# EAGLE design SRX-Sensor-Panel (EAGLE 8.4.1)
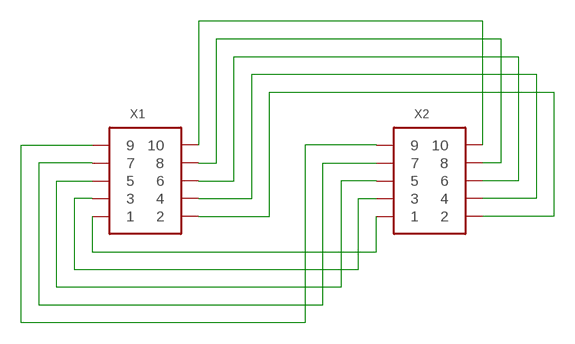
[diagram p0: schematic, sheet 1]

## Parts
X1  CONN_5-2  [FTSH-105-D]
X2  CONN_5-2  [FTSH-105-D]

## Nets
N$1: X1.1 X2.1
N$2: X1.3 X2.3
N$3: X1.5 X2.5
N$4: X1.7 X2.7
N$5: X1.9 X2.9
N$6: X1.10 X2.10
N$7: X1.2 X2.2
N$8: X1.4 X2.4
N$9: X1.6 X2.6
N$10: X1.8 X2.8

## Library data of the parts
X1 X2 = pel_misc:CONN_5-2

## Board
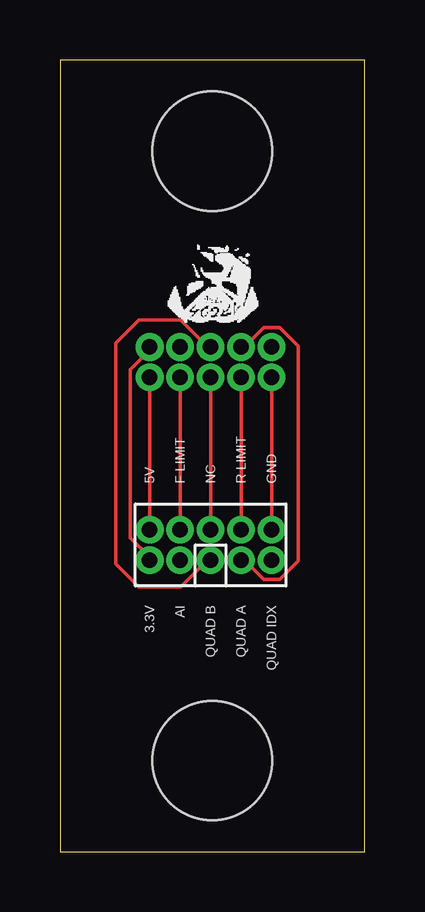
[diagram p1: board, top side]
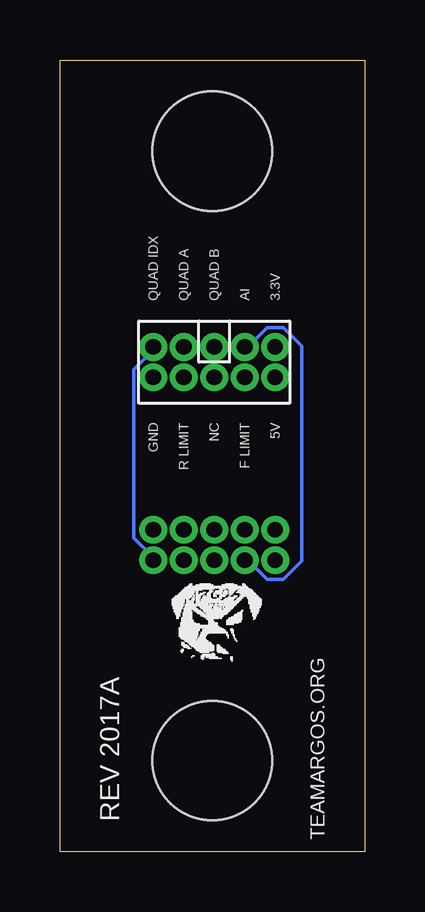
[diagram p2: board, bottom side, seen from below]

Size 12.7 x 33.02 mm. Coordinates in mm from the lower left corner, seen from the top.
Outline: 0,0 12.7,0 12.7,33.02 0,33.02 0,0
Copper layers (1*16): Top 0.035mm / dielectric 1.5mm / Bottom 0.035mm
Design rules "default": minimum track width 6mil, minimum drill 0.35mm, track to track 6mil, track to pad 6mil, pad to pad 6mil, via to via 6mil, smd to smd 6mil, copper to edge 40mil, drill to drill 6mil, minimum pad ring 10mil, minimum via ring 8mil, stop-mask expansion 4mil, vias tented up to drill 0mil, thermal gap 10mil
Holes 4.98 mm at 6.35,3.81 6.35,29.21

### Footprints (pad centres in the part's own frame; a part is rotated, then mirrored left to right if it is on the bottom)
FTSH-105-D = drill 0.65 pad 0.913: 1 -2.54,-0.635; 2 -2.54,0.635; 3 -1.27,-0.635; 4 -1.27,0.635; 5 0,-0.635; 6 0,0.635; 7 1.27,-0.635; 8 1.27,0.635; 9 2.54,-0.635; 10 2.54,0.635

### Placement (x,y rotation side)
X1  6.27,12.8 0 top
X2  6.27,20.42 180 bottom

### Tracks (layer width: path | path; a pad name or v marks a point on that pad's centre or on a via)
N$1
  Top 0.152: X2.1 3.73,20.93 2.93,20.12 2.93,13.1 3.73,12.29 X1.1
N$2  (via drill 0.35)
  Top 0.152: X2.3 v4.88,21.06
  Bottom 0.152: v4.88,21.06 4.07,21.86 3.4,21.86 2.62,21.09 2.62,12.14 3.4,11.36 4.07,11.36 4.88,12.17 X1.3
N$3
  Top 0.152: X2.5 6.15,21.06 5.03,22.17 3.27,22.17 2.32,21.21 2.32,12.01 3.27,11.05 5.03,11.05 6.15,12.17 X1.5
N$4
  Top 0.152: X2.7 7.67,21.06 8.48,21.86 9.15,21.86 9.93,21.09 9.93,12.14 9.15,11.36 8.48,11.36 7.67,12.17 X1.7
N$5  (via drill 0.35)
  Top 0.152: X2.9 v8.81,20.93
  Bottom 0.152: X1.9 8.81,12.29 9.62,13.1 9.62,20.12 v8.81,20.93
N$6
  Top 0.152: X2.10 X1.10
N$7
  Top 0.152: X2.2 X1.2
N$8
  Top 0.152: X1.4 X2.4
N$9
  Top 0.152: X2.6 X1.6
N$10
  Top 0.152: X1.8 X2.8

### Text on the board
tPlace: 5V | F LIMIT | NC | R LIMIT | GND | 3.3V | AI | QUAD B | QUAD A | QUAD IDX
bPlace: 3.3V | AI | QUAD B | QUAD A | QUAD IDX | 5V | F LIMIT | NC | R LIMIT | GND | TEAMARGOS.ORG | REV 2017A